# Altium schematic sheet Modular.SchDoc
size A4; Organization: Altium Limited; Address1: L3, 12a Rodborough Rd; Address2: Frenchs Forest; Address3: NSW; Address4: Australia 2086
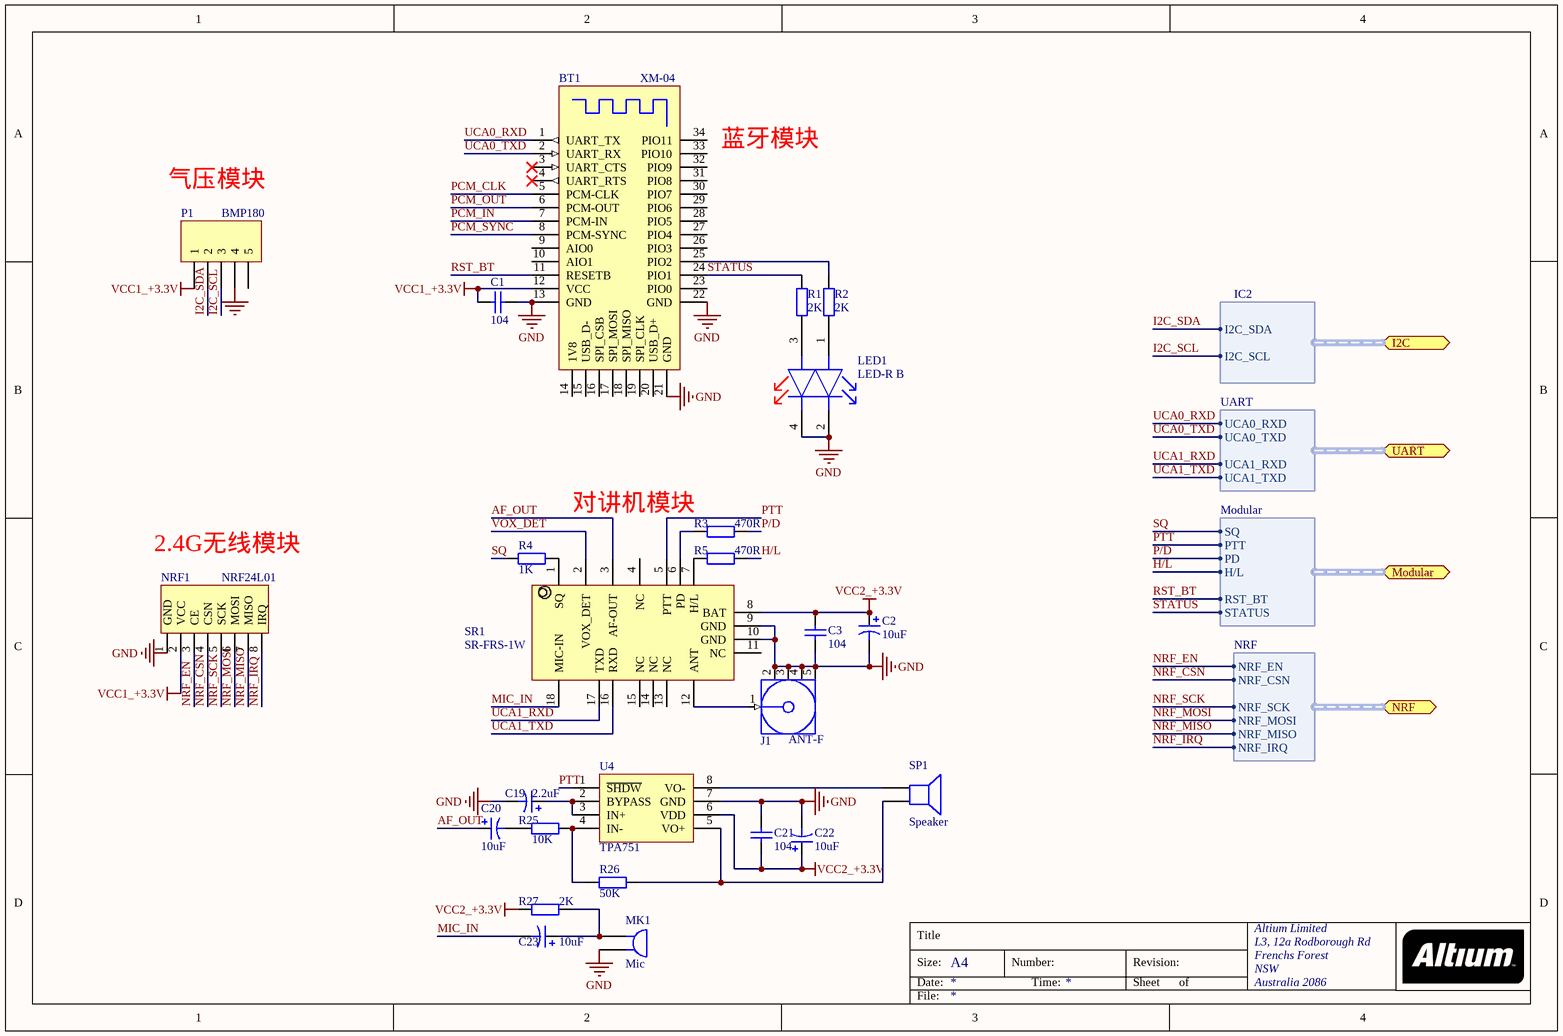
[diagram p0: Modular.SchDoc]

## Parts
BT1  XM-04  [XM-04]
C1  value 104  [C0805]  (hidden comment: Cap)
C2  value 10uF  [SMA-C]  (hidden comment: Cap Pol1)
C3  value 104  [C0805]  (hidden comment: Cap)
C19  value 2.2uF  [C3216A]  (hidden comment: Cap Pol1)
C20  value 10uF  [SMA-C]  (hidden comment: Cap Pol1)
C21  value 104  [C0805]  (hidden comment: Cap)
C22  value 10uF  [SMA-C]  (hidden comment: Cap Pol1)
C23  value 10uF  [SMA-C]  (hidden comment: Cap Pol1)
J1  ANT-F  [MCX5.08-H5]
LED1  LED-R B  [0805LED - r b]
MK1  Mic  [PIN2]
NRF1  NRF24L01  [NRF24L01]
P1  BMP180  [BMP-180]
R1  value 2K  [R0805]  (hidden comment: Res2)
R2  value 2K  [R0805]  (hidden comment: Res2)
R3  value 470R  [R0805]  (hidden comment: Res2)
R4  value 1K  [R0805]  (hidden comment: Res2)
R5  value 470R  [R0805]  (hidden comment: Res2)
R25  value 10K  [R0805]  (hidden comment: Res2)
R26  value 50K  [R0805]  (hidden comment: Res2)
R27  value 2K  [R0805]  (hidden comment: Res2)
SP1  Speaker  [PIN2]
SR1  SR-FRS-1W  [SR-FRS-1W]
U4  TPA751  [SO-8]

## Ports
I2C (harness IC2), Modular (harness Modular), NRF (harness NRF), UART (harness UART)

## Harnesses
IC2: I2C_SDA, I2C_SCL
UART: UCA0_RXD, UCA0_TXD, UCA1_RXD, UCA1_TXD
Modular: SQ, PTT, PD, H/L, RST_BT, STATUS
NRF: NRF_EN, NRF_CSN, NRF_SCK, NRF_MOSI, NRF_MISO, NRF_IRQ

## Nets
GND: BT1.13(GND) BT1.21(GND) BT1.22(GND) C1.1 C2.2 C3.2 C19.2 C21.2 C22.2 J1.2(GND) J1.3(GND) J1.4(GND) J1.5(GND) LED1.2 LED1.4 MK1.2 NRF1.1(GND) P1.4 SR1.9(GND) SR1.10(GND) U4.7(GND)
VCC1_+3.3V: BT1.12(VCC) C1.2 NRF1.2(VCC) P1.1
VCC2_+3.3V: C2.1 C3.1 C21.1 C22.1 R27.2 SR1.8(BAT) U4.6(VDD)
AF_OUT: C20.1 SR1.3(AF-OUT)
H/L: R5.2 ; port Modular.H/L
I2C_SCL: P1.3 ; port I2C.I2C_SCL
I2C_SDA: P1.2 ; port I2C.I2C_SDA
MIC_IN: C23.2 SR1.18(MIC-IN)
NRF_CSN: NRF1.4(CSN) ; port NRF.NRF_CSN
NRF_EN: NRF1.3(CE) ; port NRF.NRF_EN
NRF_IRQ: NRF1.8(IRQ) ; port NRF.NRF_IRQ
NRF_MISO: NRF1.7(MISO) ; port NRF.NRF_MISO
NRF_MOSI: NRF1.6(MOSI) ; port NRF.NRF_MOSI
NRF_SCK: NRF1.5(SCK) ; port NRF.NRF_SCK
P/D: R3.1 ; port Modular.PD
PCM_CLK: BT1.5(PCM-CLK)
PCM_IN: BT1.7(PCM-IN)
PCM_OUT: BT1.6(PCM-OUT)
PCM_SYNC: BT1.8(PCM-SYNC)
PTT: SR1.5(PTT) U4.1(~{SHDW}) ; port Modular.PTT
RST_BT: BT1.11(RESETB) ; port Modular.RST_BT
SQ: R4.2 ; port Modular.SQ
STATUS: BT1.24(PIO1) R1.1 ; port Modular.STATUS
UCA0_RXD: BT1.1(UART_TX) ; port UART.UCA0_RXD
UCA0_TXD: BT1.2(UART_RX) ; port UART.UCA0_TXD
UCA1_RXD: SR1.17(TXD) ; port UART.UCA1_RXD
UCA1_TXD: SR1.16(RXD) ; port UART.UCA1_TXD
VOX_DET: SR1.2(VOX_DET)
NetBT1_25: BT1.25(PIO2) R2.1
NetC19_1: C19.1 U4.2(BYPASS) U4.3(IN+)
NetC20_2: C20.2 R25.2
NetC23_1: C23.1 MK1.1 R27.1
NetJ1_1: J1.1(Signal) SR1.12(ANT)
NetLED1_1: LED1.1 R2.2
NetLED1_3: LED1.3 R1.2
NetR3_2: R3.2 SR1.6(PD)
NetR4_1: R4.1 SR1.1(SQ)
NetR5_1: R5.1 SR1.7(H/L)
NetR25_1: R25.1 R26.2 U4.4(IN-)
NetR26_1: R26.1 SP1.2 U4.5(VO+)
NetSP1_1: SP1.1 U4.8(VO-)

Not connected (* = marked no-connect by the designer): BT1 3(UART_CTS)* 4(UART_RTS)* 9(AIO0) 10(AIO1) 14(1V8) 15(USB_D-) 16(SPI_CSB) 17(SPI_MOSI) 18(SPI_MISO) 19(SPI_CLK) 20(USB_D+) 23(PIO0) 26(PIO3) 27(PIO4) 28(PIO5) 29(PIO6) 30(PIO7) 31(PIO8) 32(PIO9) 33(PIO10) 34(PIO11); P1 5; SR1 4(NC) 11(NC) 13(NC) 14(NC) 15(NC)

## Notes on the sheet
- (near BT1) 蓝牙模块
- 气压模块
- 对讲机模块
- 2.4G无线模块
- Title
- Size:
- Date:
- A4
- Number:
- Time:
- Revision:
- Sheet
- of
- File:

## Library data of the parts
C1 C3 C21 = Cap: Capacitor; Published: 8-Jun-2000; LatestRevisionDate: 17-Jul-2002; LatestRevisionNote: Re-released for DXP Platform.; PackageReference: RAD-0.3; Publisher: Altium Limited; PackageDescription: Radial Cap, Thru-Hole; 2 Leads; 0.3 in Pin Spacing
C2 C19 C20 C22 C23 = Cap Pol1: Polarized Capacitor (Radial); Published: 8-Jun-2000; LatestRevisionDate: 17-Jul-2002; LatestRevisionNote: Re-released for DXP Platform.; PackageReference: RB7.6-15; Publisher: Altium Limited; PackageDescription: Polarized Capacitor (Radial); 2 Leads
J1 = COAX-F: RF Coaxial PCB Connector, MCX; Thru-Hole, Right-Angle Mount Socket, Blunt Post Terminal, 50 Ohm Impedance; PCB_Layout: Complies with manufacturer's recommendation.; DrillSize: Corresponds to nominal value.; Published: 15-Jul-2004; LatestRevisionDate: 15-Jul-2004; LatestRevisionNote: Component Replaced.; DatasheetDocument: 30-May-2003; PackageDocument: 04-Jul-1999; PackageReference: 919-119J-51AX; Publisher: Altium Limited; ComponentLink1Description: Manufacturer Link; ComponentLink1URL: http://www.amphenolrf.com/
MK1 = Mic1: Microphone; Published: 24-Mar-1999; LatestRevisionDate: 17-Jul-2002; LatestRevisionNote: Re-released for DXP Platform.; PackageReference: PIN2; Publisher: Altium Limited
P1 = Header 5: Header, 5-Pin; LatestRevisionDate: 17-Jul-2002; LatestRevisionNote: Re-released for DXP Platform.; Publisher: Altium Limited
R1-R5 R25-R27 = Res2: Resistor; Published: 8-Jun-2000; LatestRevisionDate: 17-Jul-2002; LatestRevisionNote: Re-released for DXP Platform.; PackageReference: AXIAL-0.4; Publisher: Altium Limited; PackageDescription: Axial Device, Thru-Hole; 2 Leads; 0.4 in Pin Spacing
SP1 = Speaker: Loudspeaker; Published: 24-Mar-1999; LatestRevisionDate: 17-Jul-2002; LatestRevisionNote: Re-released for DXP Platform.; PackageReference: PIN2; Publisher: Altium Limited
U4 = TPA751: 700mW AB类OP